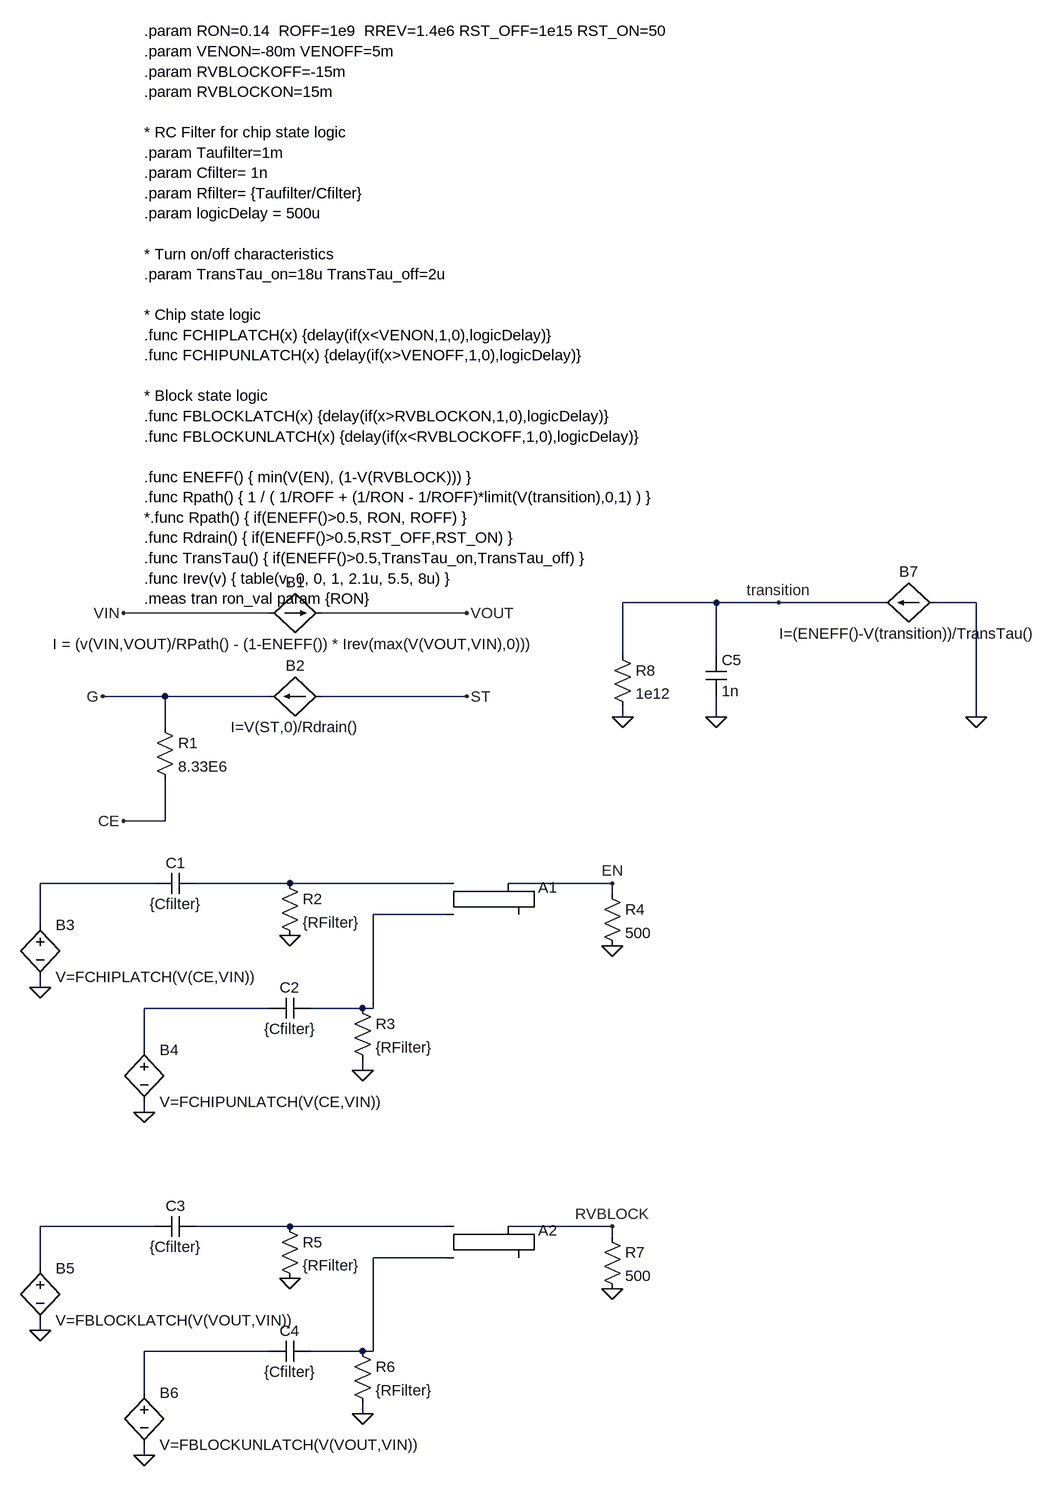
[diagram p0: schematic LM66100.asc]
LM66100.asc, the LTspice schematic file:
Version 4.1
SHEET 1 1724 1236
WIRE 928 -224 784 -224
WIRE 1024 -224 928 -224
WIRE 1184 -224 1024 -224
WIRE 1328 -224 1264 -224
WIRE 240 -208 16 -208
WIRE 544 -208 320 -208
WIRE 784 -144 784 -224
WIRE 928 -144 928 -224
WIRE 80 -80 -16 -80
WIRE 240 -80 80 -80
WIRE 544 -80 320 -80
WIRE 784 -48 784 -64
WIRE 928 -48 928 -80
WIRE 1328 -48 1328 -224
WIRE 80 -32 80 -80
WIRE 80 112 80 48
WIRE 80 112 16 112
WIRE 64 208 -112 208
WIRE 272 208 128 208
WIRE 512 208 272 208
WIRE 768 208 608 208
WIRE 768 224 768 208
WIRE 512 256 400 256
WIRE -112 272 -112 208
WIRE -112 368 -112 352
WIRE 240 400 48 400
WIRE 384 400 304 400
WIRE 400 400 400 256
WIRE 400 400 384 400
WIRE 48 464 48 400
WIRE 384 496 384 480
WIRE 48 560 48 544
WIRE 64 736 -112 736
WIRE 272 736 128 736
WIRE 512 736 272 736
WIRE 768 736 608 736
WIRE 768 752 768 736
WIRE 512 784 400 784
WIRE -112 800 -112 736
WIRE -112 896 -112 880
WIRE 240 928 48 928
WIRE 384 928 304 928
WIRE 400 928 400 784
WIRE 400 928 384 928
WIRE 48 992 48 928
WIRE 384 1024 384 1008
WIRE 48 1088 48 1072
FLAG 16 -208 VIN
FLAG 16 112 CE
FLAG 544 -80 ST
FLAG 544 -208 VOUT
FLAG -16 -80 G
FLAG -112 368 0
FLAG 48 560 0
FLAG 272 288 0
FLAG 384 496 0
FLAG 768 304 0
FLAG 768 208 EN
FLAG -112 896 0
FLAG 48 1088 0
FLAG 272 816 0
FLAG 384 1024 0
FLAG 768 832 0
FLAG 768 736 RVBLOCK
FLAG 928 -48 0
FLAG 1328 -48 0
FLAG 1024 -224 transition
FLAG 784 -48 0
SYMBOL bi2 320 -208 R90
WINDOW 0 -32 40 VBottom 2
WINDOW 3 32 40 VTop 2
SYMATTR InstName B1
SYMATTR Value I = (v(VIN,VOUT)/RPath() - (1-ENEFF()) * Irev(max(V(VOUT,VIN),0)))
SYMBOL bi2 240 -80 R270
WINDOW 0 32 40 VTop 2
WINDOW 3 -32 40 VBottom 2
SYMATTR InstName B2
SYMATTR Value I=V(ST,0)/Rdrain()
SYMBOL res 64 -48 R0
SYMATTR InstName R1
SYMATTR Value 8.33E6
SYMBOL Digital\\srflop 560 160 R0
WINDOW 3 -40 28 Invisible 2
SYMATTR Value Vhigh=1 Vlow=0 Td=1u Trise=5n Tfall=5n ic=1
SYMATTR InstName A1
SYMBOL bv -112 256 R0
SYMATTR InstName B3
SYMATTR Value V=FCHIPLATCH(V(CE,VIN))
SYMBOL bv 48 448 R0
SYMATTR InstName B4
SYMATTR Value V=FCHIPUNLATCH(V(CE,VIN))
SYMBOL res 256 192 R0
SYMATTR InstName R2
SYMATTR Value {RFilter}
SYMBOL res 368 384 R0
SYMATTR InstName R3
SYMATTR Value {RFilter}
SYMBOL cap 128 192 R90
WINDOW 0 0 32 VBottom 2
WINDOW 3 32 32 VTop 2
SYMATTR InstName C1
SYMATTR Value {Cfilter}
SYMBOL cap 304 384 R90
WINDOW 0 0 32 VBottom 2
WINDOW 3 32 32 VTop 2
SYMATTR InstName C2
SYMATTR Value {Cfilter}
SYMBOL res 752 208 R0
SYMATTR InstName R4
SYMATTR Value 500
SYMBOL Digital\\srflop 560 688 R0
WINDOW 3 -40 28 Invisible 2
SYMATTR Value Vhigh=1 Vlow=0 Td=1u Trise=5n Tfall=5n ic=0
SYMATTR InstName A2
SYMBOL bv -112 784 R0
SYMATTR InstName B5
SYMATTR Value V=FBLOCKLATCH(V(VOUT,VIN))
SYMBOL bv 48 976 R0
SYMATTR InstName B6
SYMATTR Value V=FBLOCKUNLATCH(V(VOUT,VIN))
SYMBOL res 256 720 R0
SYMATTR InstName R5
SYMATTR Value {RFilter}
SYMBOL res 368 912 R0
SYMATTR InstName R6
SYMATTR Value {RFilter}
SYMBOL cap 128 720 R90
WINDOW 0 0 32 VBottom 2
WINDOW 3 32 32 VTop 2
SYMATTR InstName C3
SYMATTR Value {Cfilter}
SYMBOL cap 304 912 R90
WINDOW 0 0 32 VBottom 2
WINDOW 3 32 32 VTop 2
SYMATTR InstName C4
SYMATTR Value {Cfilter}
SYMBOL res 752 736 R0
SYMATTR InstName R7
SYMATTR Value 500
SYMBOL cap 912 -144 R0
SYMATTR InstName C5
SYMATTR Value 1n
SYMBOL bi2 1184 -224 R270
WINDOW 0 32 40 VTop 2
WINDOW 3 -32 40 VBottom 2
SYMATTR InstName B7
SYMATTR Value I=(ENEFF()-V(transition))/TransTau()
SYMBOL res 768 -160 R0
SYMATTR InstName R8
SYMATTR Value 1e12
TEXT 48 -1104 Left 2 !.param RON=0.14  ROFF=1e9  RREV=1.4e6 RST_OFF=1e15 RST_ON=50\n.param VENON=-80m VENOFF=5m\n.param RVBLOCKOFF=-15m\n.param RVBLOCKON=15m\n \n* RC Filter for chip state logic\n.param Taufilter=1m\n.param Cfilter= 1n\n.param Rfilter= {Taufilter/Cfilter}\n.param logicDelay = 500u\n \n* Turn on/off characteristics\n.param TransTau_on=18u TransTau_off=2u\n \n* Chip state logic\n.func FCHIPLATCH(x) {delay(if(x<VENON,1,0),logicDelay)}\n.func FCHIPUNLATCH(x) {delay(if(x>VENOFF,1,0),logicDelay)}\n \n* Block state logic\n.func FBLOCKLATCH(x) {delay(if(x>RVBLOCKON,1,0),logicDelay)}\n.func FBLOCKUNLATCH(x) {delay(if(x<RVBLOCKOFF,1,0),logicDelay)}\n \n.func ENEFF() { min(V(EN), (1-V(RVBLOCK))) }\n.func Rpath() { 1 / ( 1/ROFF + (1/RON - 1/ROFF)*limit(V(transition),0,1) ) }\n*.func Rpath() { if(ENEFF()>0.5, RON, ROFF) }\n.func Rdrain() { if(ENEFF()>0.5,RST_OFF,RST_ON) }\n.func TransTau() { if(ENEFF()>0.5,TransTau_on,TransTau_off) }\n.func Irev(v) { table(v, 0, 0, 1, 2.1u, 5.5, 8u) }\n.meas tran ron_val param {RON}

The netlist it stands for:
* LM66100.asc
B1 VIN VOUT I = (v(VIN,VOUT)/RPath() - (1-ENEFF()) * Irev(max(V(VOUT,VIN),0)))
B2 ST G I=V(ST,0)/Rdrain()
R1 G CE 8.33E6
A1 N002 N003 0 0 0 0 EN 0 SRFLOP Vhigh=1 Vlow=0 Td=1u Trise=5n Tfall=5n ic=1
B3 N001 0 V=FCHIPLATCH(V(CE,VIN))
B4 N004 0 V=FCHIPUNLATCH(V(CE,VIN))
R2 N002 0 {RFilter}
R3 N003 0 {RFilter}
C1 N002 N001 {Cfilter}
C2 N003 N004 {Cfilter}
R4 EN 0 500
A2 N006 N007 0 0 0 0 RVBLOCK 0 SRFLOP Vhigh=1 Vlow=0 Td=1u Trise=5n Tfall=5n ic=0
B5 N005 0 V=FBLOCKLATCH(V(VOUT,VIN))
B6 N008 0 V=FBLOCKUNLATCH(V(VOUT,VIN))
R5 N006 0 {RFilter}
R6 N007 0 {RFilter}
C3 N006 N005 {Cfilter}
C4 N007 N008 {Cfilter}
R7 RVBLOCK 0 500
C5 transition 0 1n
B7 0 transition I=(ENEFF()-V(transition))/TransTau()
R8 transition 0 1e12
.param RON=0.14  ROFF=1e9  RREV=1.4e6 RST_OFF=1e15 RST_ON=50
.param VENON=-80m VENOFF=5m
.param RVBLOCKOFF=-15m
.param RVBLOCKON=15m
* RC Filter for chip state logic
.param Taufilter=1m
.param Cfilter= 1n
.param Rfilter= {Taufilter/Cfilter}
.param logicDelay = 500u
* Turn on/off characteristics
.param TransTau_on=18u TransTau_off=2u
* Chip state logic
.func FCHIPLATCH(x) {delay(if(x<VENON,1,0),logicDelay)}
.func FCHIPUNLATCH(x) {delay(if(x>VENOFF,1,0),logicDelay)}
* Block state logic
.func FBLOCKLATCH(x) {delay(if(x>RVBLOCKON,1,0),logicDelay)}
.func FBLOCKUNLATCH(x) {delay(if(x<RVBLOCKOFF,1,0),logicDelay)}
.func ENEFF() { min(V(EN), (1-V(RVBLOCK))) }
.func Rpath() { 1 / ( 1/ROFF + (1/RON - 1/ROFF)*limit(V(transition),0,1) ) }
*.func Rpath() { if(ENEFF()>0.5, RON, ROFF) }
.func Rdrain() { if(ENEFF()>0.5,RST_OFF,RST_ON) }
.func TransTau() { if(ENEFF()>0.5,TransTau_on,TransTau_off) }
.func Irev(v) { table(v, 0, 0, 1, 2.1u, 5.5, 8u) }
.meas tran ron_val param {RON}
.backanno
.end